# EAGLE design generic_micro_2 (EAGLE 7.3.0)
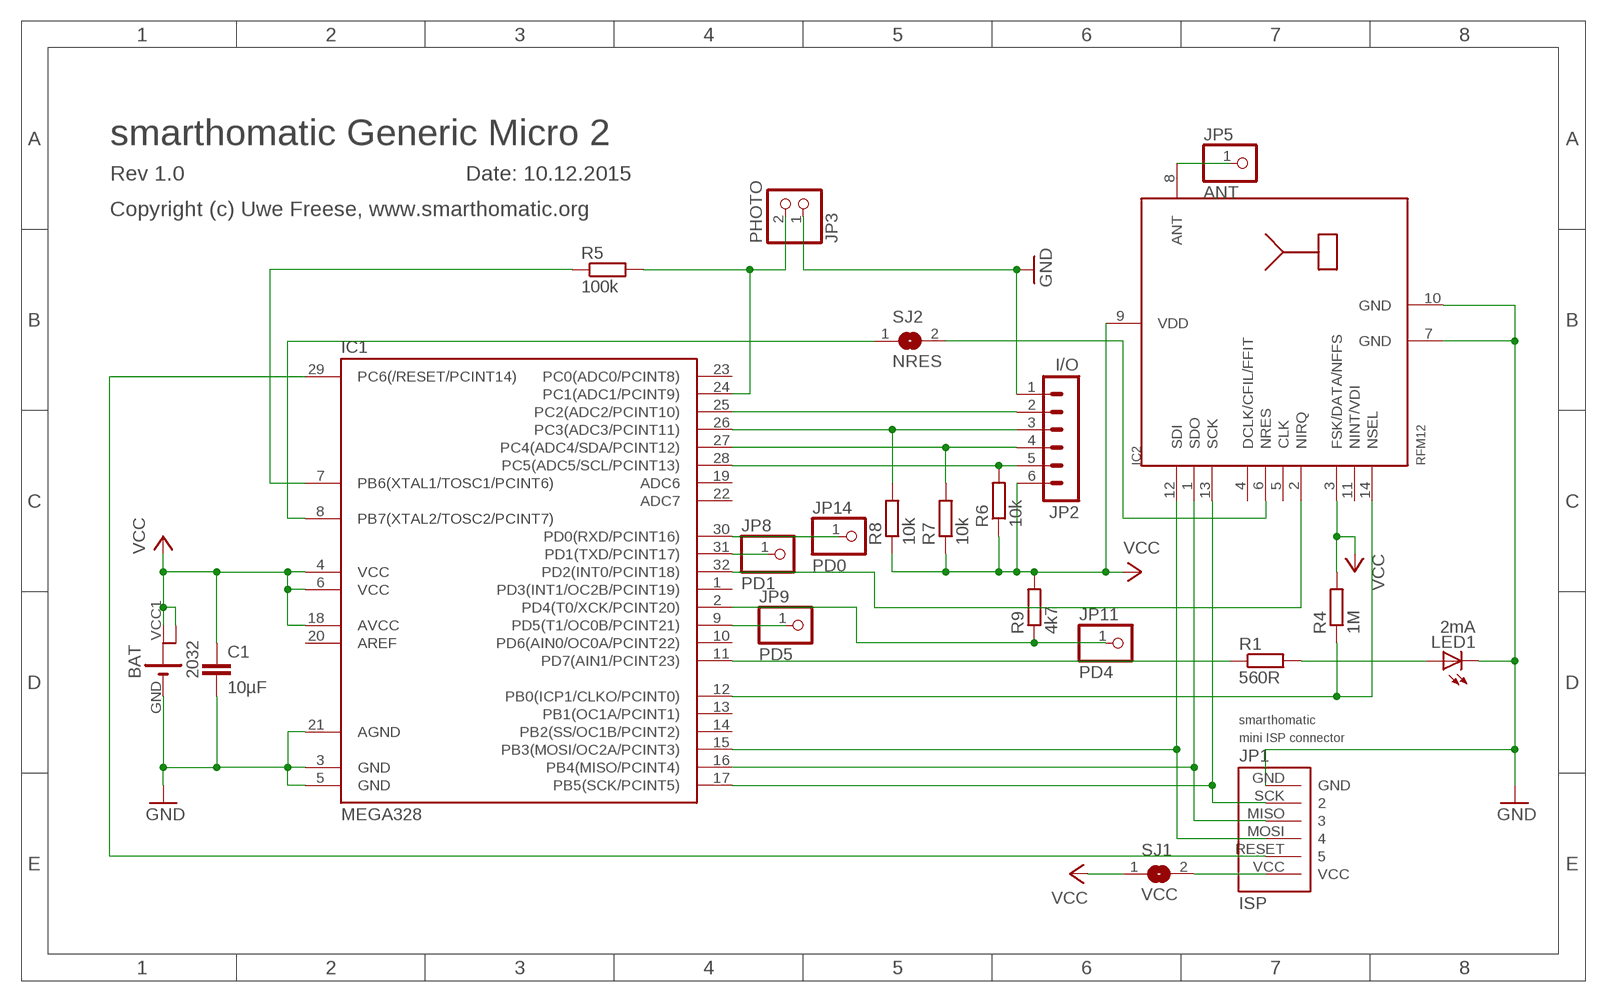
[diagram p0: schematic, sheet 1]

## Parts
BAT  2032  [KZH20SMD]
C1  10µF  C-EUC0603  [C0603]
IC1  MEGA328  MEGA48/88/168-AU  [TQFP32-08]
IC2  RFM12  [RFM]
JP1  ISP  SHC_MINI_ISPP  [PINHD_1X6_1.27]
JP2  I/O  MA06-1  [MA06-1]
JP3  PHOTO  PINHD-1X2  [1X02]
JP5  ANT  PINHD-1X1  [1X01]
JP8  PD1  PINHD-1X1  [1X01]
JP9  PD5  PINHD-1X1  [1X01]
JP11  PD4  PINHD-1X1  [1X01]
JP14  PD0  PINHD-1X1  [1X01]
LED1  2mA  LED3MM  [LED3MM]
R1  560R  R-EU_R0603  [R0603]
R4  1M  R-EU_R0603  [R0603]
R5  100k  R-EU_R0603  [R0603]
R6  10k  R-EU_R0603  [R0603]
R7  10k  R-EU_R0603  [R0603]
R8  10k  R-EU_R0603  [R0603]
R9  4k7  R-EU_R0603  [R0603]
SJ1  VCC  SJ  [SJ]
SJ2  NRES  SJ  [SJ]

## Nets
GND: BAT.GND C1.2 IC1.3(GND) IC1.5(GND) IC1.21(AGND) IC2.7(GND) IC2.10(GND) JP1.GND JP2.1 JP3.1 LED1.K(C)
N$1: JP1.VCC SJ1.2
N$2: IC1.26(PC3(ADC3/PCINT11)) JP2.3 R8.2
N$3: IC1.15(PB3(MOSI/OC2A/PCINT3)) IC2.12(SDI) JP1.MOSI
N$4: IC1.16(PB4(MISO/PCINT4)) IC2.1(SDO) JP1.MISO
N$5: IC1.17(PB5(SCK/PCINT5)) IC2.13(SCK) JP1.SCK
N$6: IC1.11(PD7(AIN1/PCINT23)) R1.1
N$7: IC1.27(PC4(ADC4/SDA/PCINT12)) JP2.4 R7.2
N$8: IC1.29(PC6(/RESET/PCINT14)) JP1.RESET
N$9: IC1.28(PC5(ADC5/SCL/PCINT13)) JP2.5 R6.2
N$10: IC1.24(PC1(ADC1/PCINT9)) JP3.2 R5.2
N$11: IC1.7(PB6(XTAL1/TOSC1/PCINT6)) R5.1
N$12: LED1.A R1.2
N$13: IC1.12(PB0(ICP1/CLKO/PCINT0)) IC2.14(NSEL) R4.1
N$14: IC1.30(PD0(RXD/PCINT16)) JP14.1
N$15: IC1.32(PD2(INT0/PCINT18)) IC2.2(NIRQ)
N$16: IC2.8(ANT) JP5.1
N$17: IC1.2(PD4(T0/XCK/PCINT20)) JP11.1 R9.1
N$18: IC1.8(PB7(XTAL2/TOSC2/PCINT7)) SJ2.1
N$19: IC2.6(NRES) SJ2.2
N$20: IC1.25(PC2(ADC2/PCINT10)) JP2.2
N$21: IC1.31(PD1(TXD/PCINT17)) JP8.1
N$22: IC1.9(PD5(T1/OC0B/PCINT21)) JP9.1
VCC: BAT.VCC1 BAT.VCC2 C1.1 IC1.4(VCC) IC1.6(VCC) IC1.18(AVCC) IC2.3(FSK/DATA/NFFS) IC2.9(VDD) JP2.6 R4.2 R6.1 R7.1 R8.1 R9.2 SJ1.1
Unconnected: IC1.1(PD3(INT1/OC2B/PCINT19)) IC1.10(PD6(AIN0/OC0A/PCINT22)) IC1.13(PB1(OC1A/PCINT1)) IC1.14(PB2(SS/OC1B/PCINT2)) IC1.19(ADC6) IC1.20(AREF) IC1.22(ADC7) IC1.23(PC0(ADC0/PCINT8)) IC2.4(DCLK/CFIL/FFIT) IC2.5(CLK) IC2.11(NINT/VDI)

## Notes on the sheet
- smarthomatic Generic Micro 2
- Rev 1.0 | Date: 10.12.2015
- Copyright (c) Uwe Freese, www.smarthomatic.org

## Library data of the parts
BAT = battery_holder_2032:2032
C1 = resistor:C-EU: CAPACITOR, European symbol
IC1 = avr-5-4.16:MEGA48/88/168
IC2 = hopeRF:RFM12
JP1 = shc_mini_isp:SHC_MINI_ISP: smarthomatic mini ISP connector, 1.27mm grid
JP2 = con-lstb:MA06-1: PIN HEADER; OC_FARNELL: unknown; OC_NEWARK: unknown
JP3 = pinhead:PINHD-1X2: PIN HEADER
JP5 JP8 JP9 JP11 JP14 = pinhead:PINHD-1X1: PIN HEADER
LED1 = led:LED: LED OSRAM: - CHIPLED LG R971, LG N971, LY N971, LG Q971, LY Q971, LO R971, LY R971 LH N974, LH R974 LS Q976, LO Q976, LY Q976 LO Q996 - Hyper CHIPLED LW Q18S LB Q993, LB Q99A, LB R99A - SideLED LS A670, LO A670, LY A670, LG A670, LP A670 LB A673, LV A673, LT A673, LW A673 LH A674 LY A675 LS A676, LA A676, LO A676, LY A676, LW A676 LS A679, LY A679, LG A679 - Hyper Micro SIDELED® LS Y876, LA Y876, LO Y876, LY Y876 LT Y87S - SmartLED LW L88C, LW L88S LB L89C, LB L89S, LG L890 LS L89K, LO L89K, LY L89K LS L896, LA L896, LO L896, LY L896 - TOPLED LS T670, LO T670, LY T670, LG T670, LP T670 LSG T670, LSP T670, LSY T670, LOP T670, LYG T670 LG T671, LOG T671, LSG T671 LB T673, LV T673, LT T673, LW T673 LH T674 LS T676, LA T676, LO T676, LY T676, LB T676, LH T676, LSB T676, LW T676 LB T67C, LV T67C, LT T67C, LS T67K, LO T67K, LY T67K, LW E67C LS E67B, LA E67B, LO E67B, LY E67B, LB E67C, LV E67C, LT E67C LW T67C LS T679, LY T679, LG T679 LS T770, LO T770, LY T770, LG T770, LP T770 LB T773, LV T773, LT T773, LW T773 LH T774 LS E675, LA E675, LY E675, LS T675 LS T776, LA T776, LO T776, LY T776, LB T776 LHGB T686 LT T68C, LB T68C - Hyper Mini TOPLED® LB M676 - Mini TOPLED Santana® LG M470 LS M47K, LO M47K, LY M47K Source: http://www.osram.convergy.de LUXEON: - LUMILED® LXK2-PW12-R00, LXK2-PW12-S00, LXK2-PW14-U00, LXK2-PW14-V00 LXK2-PM12-R00, LXK2-PM12-S00, LXK2-PM14-U00 LXK2-PE12-Q00, LXK2-PE12-R00, LXK2-PE12-S00, LXK2-PE14-T00, LXK2-PE14-U00 LXK2-PB12-K00, LXK2-PB12-L00, LXK2-PB12-M00, LXK2-PB14-N00, LXK2-PB14-P00, LXK2-PB14-Q00 LXK2-PR12-L00, LXK2-PR12-M00, LXK2-PR14-Q00, LXK2-PR14-R00 LXK2-PD12-Q00, LXK2-PD12-R00, LXK2-PD12-S00 LXK2-PH12-R00, LXK2-PH12-S00 LXK2-PL12-P00, LXK2-PL12-Q00, LXK2-PL12-R00 Source: www.luxeon.com KINGBRIGHT: KA-3528ASYC Source: www.kingbright.com
R1 R4-R9 = rcl:R-EU_: RESISTOR, European symbol
SJ1 SJ2 = jumper:SJ: SMD solder JUMPER

## Board
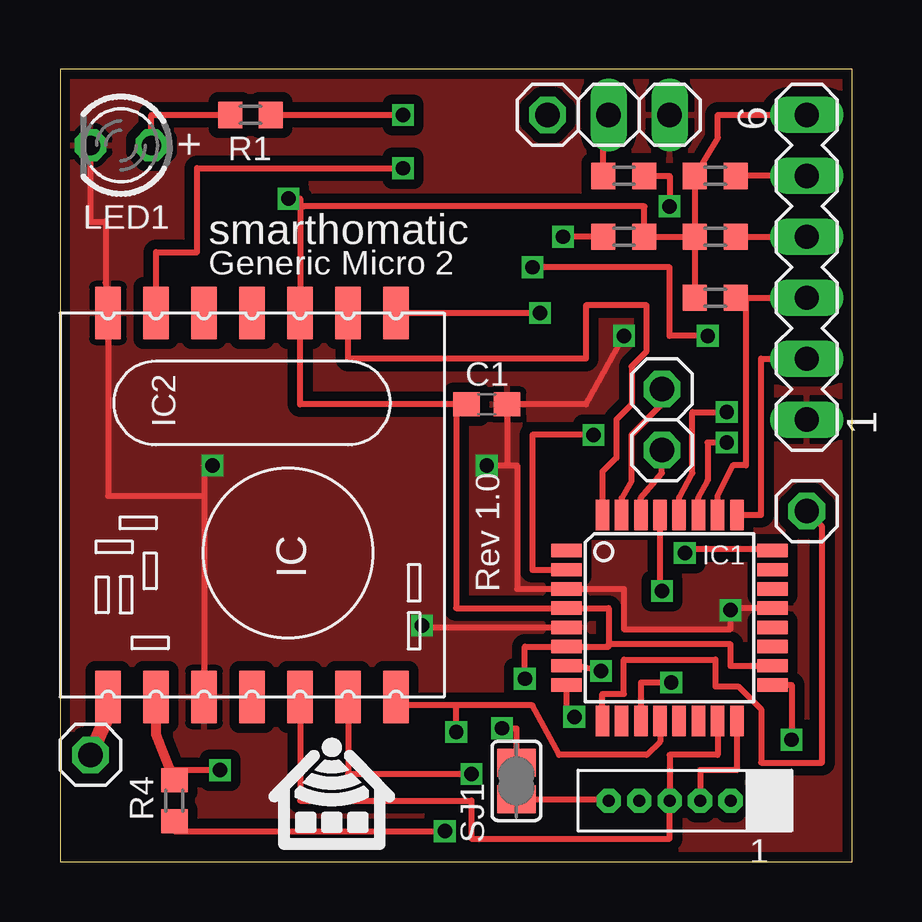
[diagram p1: board, top side]
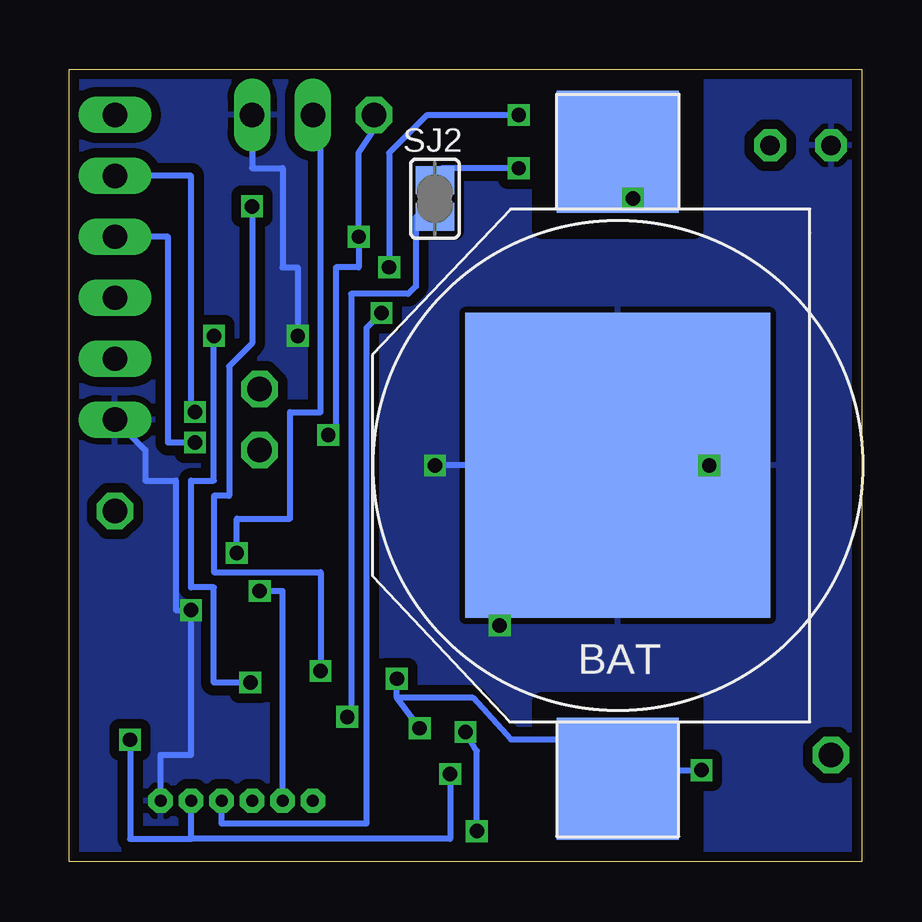
[diagram p2: board, bottom side, seen from below]

Size 33.02 x 33.01 mm. Coordinates in mm from the lower left corner, seen from the top.
Outline: 0,0 33.02,0 33.02,33.01 0,33.01 0,0
Copper layers (1*16): Top 0.035mm / dielectric 1.5mm / Bottom 0.035mm
Design rules "SeeedStudio_2layer_DRU_no_angle_20140221": minimum track width 6mil, minimum drill 12mil, track to track 6mil, track to pad 6mil, pad to pad 6mil, via to via 6mil, smd to smd 0mil, copper to edge 10mil, drill to drill 10mil, minimum pad ring 10mil, minimum via ring 6mil, stop-mask expansion 2mil, vias tented up to drill 100mil, thermal gap 10mil

### Footprints (pad centres in the part's own frame; a part is rotated, then mirrored left to right if it is on the bottom)
KZH20SMD = smd 12.7 x 12.7: GND 0,0 | smd 5.08 x 5.08: VCC1 -13.062,0; VCC2 13.062,0
C0603 = smd 1.1 x 1: 1 -0.85,0; 2 0.85,0
TQFP32-08 = smd 1.27 x 0.559: 1 -4.293,2.8; 2 -4.293,2; 3 -4.293,1.2; 4 -4.293,0.4; 5 -4.293,-0.4; 6 -4.293,-1.2; 7 -4.293,-2; 8 -4.293,-2.8; 17 4.293,-2.8; 18 4.293,-2; 19 4.293,-1.2; 20 4.293,-0.4; 21 4.293,0.4; 22 4.293,1.2; 23 4.293,2; 24 4.293,2.8 | smd 0.559 x 1.27: 9 -2.8,-4.293; 10 -2,-4.293; 11 -1.2,-4.293; 12 -0.4,-4.293; 13 0.4,-4.293; 14 1.2,-4.293; 15 2,-4.293; 16 2.8,-4.293; 25 2.8,4.293; 26 2,4.293; 27 1.2,4.293; 28 0.4,4.293; 29 -0.4,4.293; 30 -1.2,4.293; 31 -2,4.293; 32 -2.8,4.293
RFM = smd 2.184 x 1.067: 1 0,14; 2 0,12; 3 0,10; 4 0,8; 5 0,6; 6 0,4; 7 0,2; 8 16,2; 9 16,4; 10 16,6; 11 16,8; 12 16,10; 13 16,12; 14 16,14
PINHD_1X6_1.27 = drill 0.5 octagon: GND 0,-2.54; MISO 0,0; MOSI 0,1.27; RESET 0,2.54; SCK 0,-1.27; VCC 0,3.81
MA06-1 = drill 1.016 long: 1 -6.35,0; 2 -3.81,0; 3 -1.27,0; 4 1.27,0; 5 3.81,0; 6 6.35,0
1X02 = drill 1.016 long: 1 -1.27,0; 2 1.27,0
1X01 = drill 1.016 octagon: 1 0,0
LED3MM = drill 0.813 octagon: A -1.27,0; K 1.27,0
R0603 = smd 1 x 1.1: 1 -0.85,0; 2 0.85,0
SJ = smd 1.168 x 1.6: 1 -0.762,0; 2 0.762,0

### Placement (x,y rotation side)
BAT  10.16,16.51 90 bottom
C1  17.78,19.05 0 top
IC1  25.4,10.16 0 top
IC2  0,22.86 270 top
JP1  26.67,2.54 90 top
JP2  31.11,24.77 90 top
JP3  24.13,31.11 180 top
JP5  1.27,4.45 0 top
JP8  25.08,19.68 0 top
JP9  31.11,14.61 0 top
JP11  20.32,31.11 0 top
JP14  25.08,17.14 0 top
LED1  2.54,29.84 180 top
R1  7.94,31.11 180 top
R4  4.76,2.54 90 top
R5  23.5,28.57 180 top
R6  27.3,28.57 0 top
R7  27.3,26.04 0 top
R8  27.3,23.5 0 top
R9  23.5,26.04 0 top
SJ1  19.02,3.36 270 top
SJ2  17.78,27.62 90 bottom

### Tracks (layer width: path | path; a pad name or v marks a point on that pad's centre or on a via)
GND  (via drill 0.6)
  Top 0.254: LED1.K 1.27,26.67 1.91,26.67 1.91,24.13 IC2.7 2,15.24 6,15.24 | 29.69,10.58 IC1.21 27.94,10.56 v27.94,10.48 27.94,9.68 23.5,9.68 23.5,11.36 IC1.3 19.05,11.36 19.05,16.51 18.63,16.51 | 6,15.24 IC2.10 | 18.63,16.51 C1.2 21.91,19.05 v23.5,21.91 | v6.35,16.51 6,16.51 6,15.24 | v17.78,16.51 18.63,16.51 | v15.08,9.84 15.08,9.76 IC1.5
  Bottom 0.254: v6.35,16.51 BAT.GND 15.08,16.51 | v15.08,9.84 15.08,16.51 | 15.08,16.51 v17.78,16.51 | v23.5,21.91 23.5,24.77 24.13,24.77 24.13,28.89 25.4,28.89 JP3.1 | JP2.1 29.84,17.14 29.84,15.88 28.57,15.88 28.57,10.48 v27.94,10.48 27.94,4.45 29.21,4.45 JP1.GND
  pour Top (isolate 0.406): 0,33.02 34.29,33.02 34.29,-1.27 0,-1.27
  pour Bottom (isolate 0.406): -1.27,33.02 35.56,33.02 35.56,-2.54 -1.27,-2.54
N$1
  Top 0.254: SJ1.2 22.8,2.6 JP1.VCC
N$2
  Top 0.254: R8.2 28.57,23.5 | 28.57,23.5 28.57,16.51 28.04,16.51 27.4,15.24 IC1.26 | 28.57,23.5 JP2.3
N$3
  Top 0.254: IC1.15 27.4,4.45 25.4,4.45 JP1.MOSI 25.4,0.95 17.14,0.95 17.14,2.54 10,2.54 IC2.12
N$4  (via drill 0.6)
  Top 0.254: JP1.MISO 26.67,3.81 28.2,3.81 IC1.16 28.2,5.71 | 13.97,22.89 arc90 IC2.1 v20,22.86
  Bottom 0.254: v20,22.86 20.64,22.23 20.64,1.59 26.67,1.59 JP1.MISO
N$5  (via drill 0.6)
  Top 0.254: IC1.17 30.48,7.36 v30.48,5.08 | IC2.13 12,3.66 v17.14,3.66
  Bottom 0.254: v30.48,5.08 30.48,0.95 27.94,0.95 | 27.94,0.95 JP1.SCK | v17.14,3.66 17.14,0.95 27.94,0.95
N$6  (via drill 0.6)
  Top 0.254: R1.1 v14.29,31.11 | v26.99,21.91 25.4,21.91 25.4,24.77 v19.68,24.77 | v25.47,7.46 24.2,7.46 IC1.11
  Bottom 0.254: v25.47,7.46 26.99,7.46 26.99,11.43 27.94,11.43 27.94,15.88 26.99,15.88 v26.99,21.91 | v14.29,31.11 18.1,31.11 19.68,29.53 v19.68,24.77
N$7  (via drill 0.6)
  Top 0.254: v27.78,17.46 26.99,17.46 26.99,15.88 26.6,15.17 IC1.27 | R7.2 JP2.4
  Bottom 0.254: v27.78,17.46 28.89,17.46 28.89,26.04 JP2.4
N$8  (via drill 0.6)
  Top 0.254: v25.08,11.27 25,11.43 IC1.29
  Bottom 0.254: JP1.RESET 24.13,11.27 v25.08,11.27
N$9  (via drill 0.6)
  Top 0.254: JP2.5 R6.2 | IC1.28 25.8,15.16 26.35,16.19 26.35,18.73 v27.78,18.73
  Bottom 0.254: v27.78,18.73 27.94,18.73 27.94,28.57 JP2.5
N$10  (via drill 0.6)
  Top 0.254: IC1.24 29.69,13.02 26.04,13.02 v26.04,12.86 | R5.2 22.64,31.11 JP3.2
  Bottom 0.254: v26.04,12.86 26.04,14.29 23.81,14.29 23.81,18.73 22.54,18.73 22.54,31.11 JP3.2
N$11  (via drill 0.6)
  Top 0.254: R5.1 25.4,28.57 v25.4,27.3 | v22.54,7.94 21.11,8.26 IC1.7
  Bottom 0.254: v25.4,27.3 25.4,21.59 26.35,20.64 26.35,15.24 26.99,15.24 26.99,12.06 22.54,12.06 v22.54,7.94
N$12
  Top 0.254: LED1.A 3.81,31.11 R1.2
N$13  (via drill 0.6)
  Top 0.254: IC2.14 14,6.51 16.51,6.51 | R4.1 4.76,1.27 v16.03,1.27 | 16.51,6.51 19.68,6.51 20.8,4.45 24.45,4.45 25,5 IC1.12 | v16.51,5.4 16.51,6.51
  Bottom 0.254: v16.03,1.27 16.03,4.6 v16.51,5.4
N$14
  Top 0.254: 24.2,14.92 IC1.30 24.2,15.15 25.08,16.19 JP14.1
N$15
  Top 0.254: IC1.32 22.6,16.25 23.18,16.83 23.18,18.41 23.81,19.05 23.81,20.64 24.45,21.27 24.45,23.18 21.91,23.18 21.91,20.95 12,20.95 IC2.2
N$16
  Top 0.406: 1.91,5.91 IC2.8
  Top 0.61: JP5.1 1.91,5.91
N$17  (via drill 0.6)
  Top 0.254: R9.1 v20.95,26.04 | v22.23,17.78 19.68,17.78 19.68,12.16 IC1.2
  Bottom 0.254: JP11.1 20.32,30.48 20.95,29.53 v20.95,26.04 20.95,24.77 21.91,24.77 21.91,17.78 v22.23,17.78
N$18  (via drill 0.6)
  Top 0.254: v21.43,6.03 21.11,6.04 IC1.8
  Bottom 0.254: SJ2.1 18.57,26.86 18.57,23.97 18.89,23.65 21.27,23.65 21.27,6.03 v21.43,6.03
N$19  (via drill 0.6)
  Top 0.254: IC2.6 4,25.4 5.71,25.4 5.71,28.89 v14.29,28.89
  Bottom 0.254: v14.29,28.89 17.46,28.89 SJ2.2
N$20
  Top 0.254: IC1.25 29.21,14.45 29.21,20.95 JP2.2
N$21
  Top 0.254: IC1.31 23.4,15.14 23.81,15.88 23.81,17.78 25.08,19.05 JP8.1
N$22
  Top 0.254: IC1.9 22.6,6.99 23.5,6.99 23.5,8.41 27.3,8.41 27.3,7.3 28.26,7.3 29.21,6.35 29.21,4.13 31.75,4.13 31.75,13.97 JP9.1
VCC  (via drill 0.6)
  Top 0.254: 22.86,9.05 22.86,10.56 IC1.4 16.51,10.56 16.51,19.05 | IC1.18 27.94,8.16 27.94,9.05 22.86,9.05 | C1.1 16.51,19.05 | 16.51,19.05 10,19.05 IC2.3 10,27.62 v9.53,27.62 10.16,27.3 24.34,27.3 R9.2 R7.1 | v6.67,3.81 4.76,3.81 R4.2 | R7.1 R6.1 27.41,30.16 27.41,31.11 JP2.6 | R7.1 R8.1 | 22.86,9.05 22.86,8.96 IC1.6 19.37,8.96 v19.37,7.62 | v18.41,5.56 19.02,5.56 SJ1.1
  Top 0.406: R4.2 4,5.29 IC2.9
  Bottom 0.254: BAT.VCC2 v9.53,27.62 | BAT.VCC1 10.16,3.81 | 10.16,5.08 10.16,4.72 | 10.16,4.72 10.16,3.81 | 10.16,3.81 v6.67,3.81 | v18.41,5.56 19.37,6.83 | 19.37,6.83 v19.37,7.62 | 10.16,4.72 12.22,5.08 14.61,5.08 16.19,6.83 19.37,6.83

### Text on the board
tNames: + | smarthomatic | Generic Micro 2 | Rev 1.0
tValues: TX | RX | ISP-VCC
bValues: + | NRES | GND | +